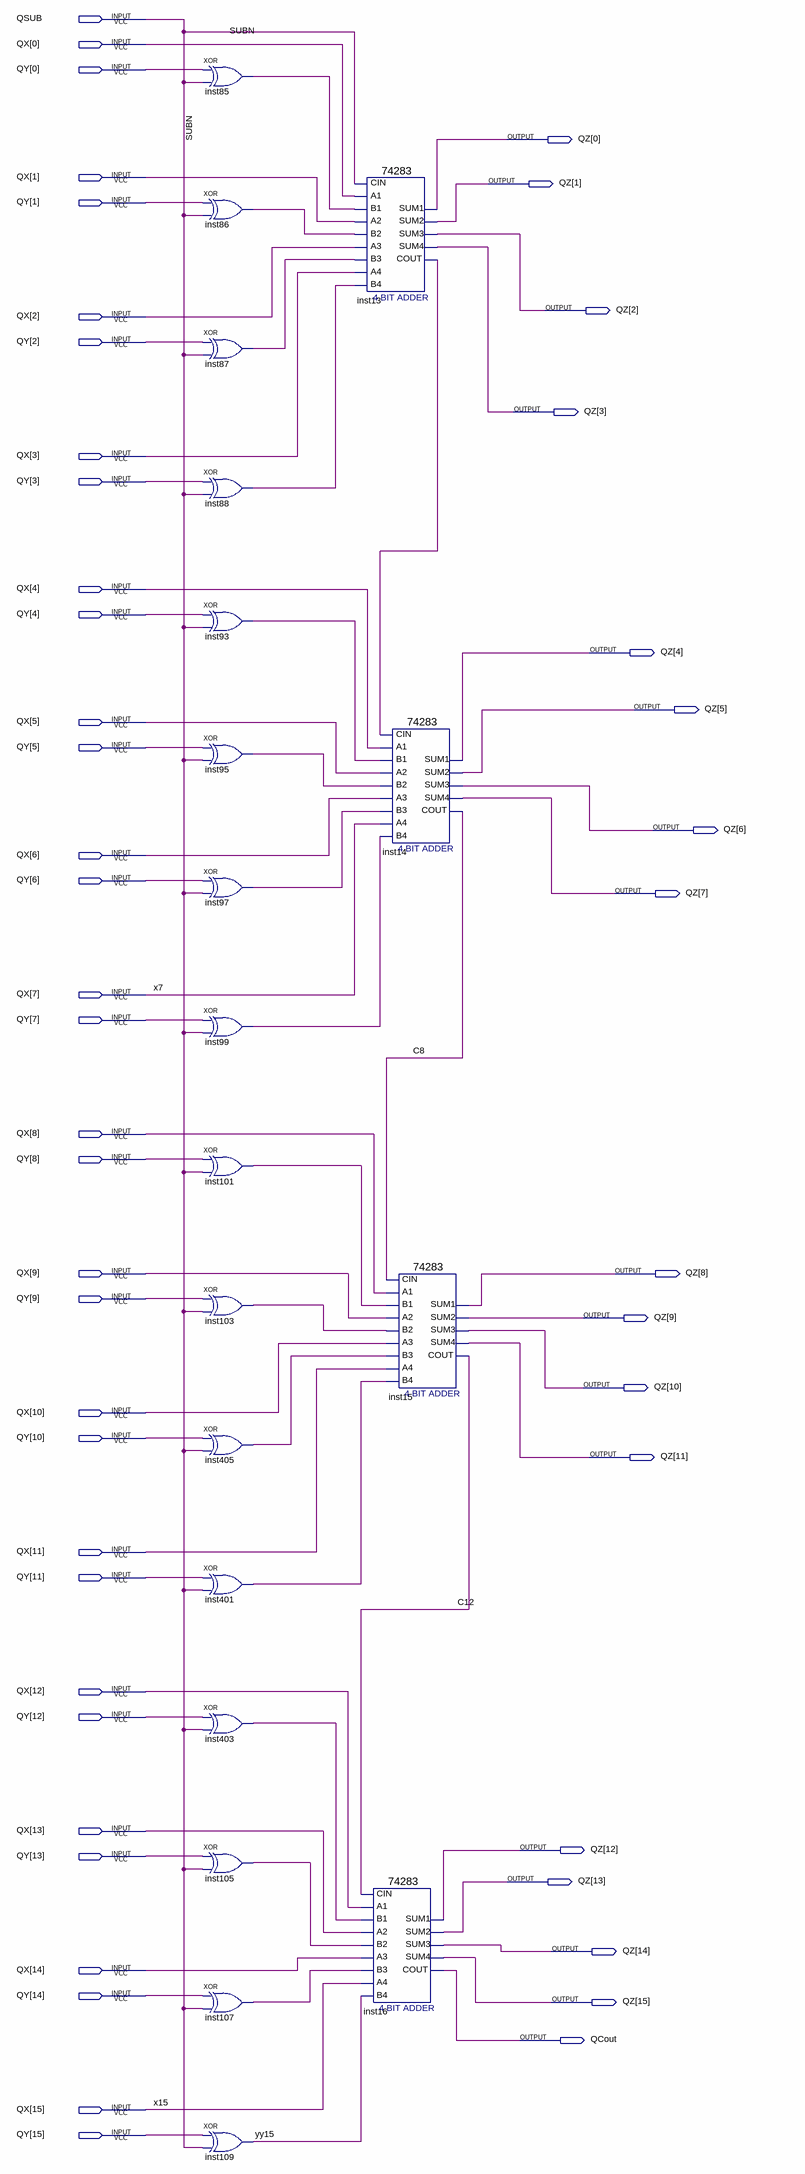
[diagram p0: schematic sheet]
// Quartus schematic QuADD.bdf as structural Verilog: 20 symbols, 50 pins
module QuADD (
  input  QSUB,
  input  [15:0] QX,
  input  [15:0] QY,
  output [15:0] QZ,
  output QCout
);

  wire C8, C12, inst13_cout, inst85_out, inst86_out, inst87_out, inst88_out, inst93_out, inst95_out,
       inst97_out, inst99_out, inst101_out, inst103_out, inst105_out, inst107_out, inst401_out, inst403_out,
       inst405_out, yy15;

  xor inst85 (inst85_out, QY[0], QSUB);
  xor inst86 (inst86_out, QY[1], QSUB);
  xor inst87 (inst87_out, QY[2], QSUB);
  xor inst88 (inst88_out, QY[3], QSUB);
  xor inst93 (inst93_out, QY[4], QSUB);
  xor inst95 (inst95_out, QY[5], QSUB);
  xor inst97 (inst97_out, QY[6], QSUB);
  xor inst99 (inst99_out, QY[7], QSUB);
  xor inst101 (inst101_out, QY[8], QSUB);
  xor inst103 (inst103_out, QY[9], QSUB);
  xor inst405 (inst405_out, QY[10], QSUB);
  xor inst401 (inst401_out, QY[11], QSUB);
  xor inst403 (inst403_out, QY[12], QSUB);
  xor inst105 (inst105_out, QY[13], QSUB);
  xor inst107 (inst107_out, QY[14], QSUB);
  xor inst109 (yy15, QY[15], QSUB);
  \74283  inst13 (
    .CIN(QSUB), .A1(QX[0]), .A2(QX[1]), .B2(inst86_out), .A3(QX[2]), .A4(QX[3]), .B4(inst88_out),
    .B1(inst85_out), .B3(inst87_out), .SUM4(QZ[3]), .COUT(inst13_cout), .SUM1(QZ[0]), .SUM2(QZ[1]),
    .SUM3(QZ[2]));
  \74283  inst14 (
    .CIN(inst13_cout), .A1(QX[4]), .A2(QX[5]), .B2(inst95_out), .A3(QX[6]), .A4(QX[7]), .B4(inst99_out),
    .B1(inst93_out), .B3(inst97_out), .SUM4(QZ[7]), .COUT(C8), .SUM1(QZ[4]), .SUM2(QZ[5]), .SUM3(QZ[6]));
  \74283  inst16 (
    .CIN(C12), .A1(QX[12]), .A2(QX[13]), .B2(inst105_out), .A3(QX[14]), .A4(QX[15]), .B4(yy15),
    .B1(inst403_out), .B3(inst107_out), .SUM4(QZ[15]), .COUT(QCout), .SUM1(QZ[12]), .SUM2(QZ[13]),
    .SUM3(QZ[14]));
  \74283  inst15 (
    .CIN(C8), .A1(QX[8]), .A2(QX[9]), .B2(inst103_out), .A3(QX[10]), .A4(QX[11]), .B4(inst401_out),
    .B1(inst101_out), .B3(inst405_out), .SUM4(QZ[11]), .COUT(C12), .SUM1(QZ[8]), .SUM2(QZ[9]), .SUM3(QZ[10]));

  // Other names for the same wires on the sheet: SUBN = QSUB; x7 = QX[7]; x15 = QX[15]
endmodule
